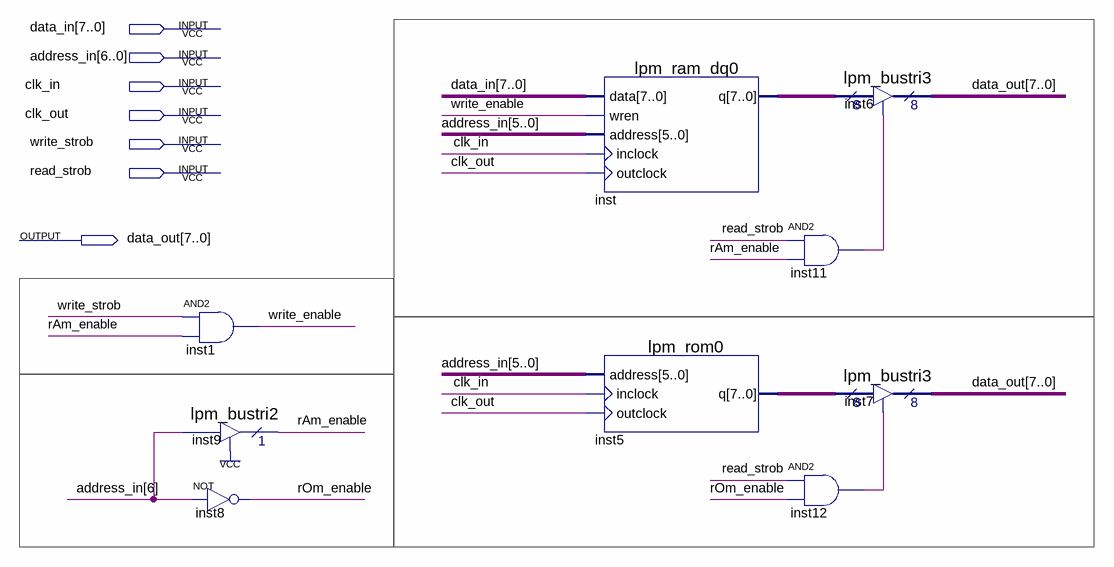
[diagram p0: schematic sheet]
// Quartus schematic MemoryBlock.bdf as structural Verilog: 9 symbols, 7 pins
module MemoryBlock (
  input  [7:0] data_in,
  input  [6:0] address_in,
  input  clk_in,
  input  clk_out,
  input  write_strob,
  input  read_strob,
  output [7:0] data_out
);

  wire inst11_out, inst12_out, rAm_enable, rOm_enable, write_enable;
  wire [7:0] inst5_q, inst_q;

  and inst1 (write_enable, write_strob, rAm_enable);
  lpm_bustri2 inst9 (.enabledt(1'b1), .data(address_in[6]), .tridata(rAm_enable));
  not inst8 (rOm_enable, address_in[6]);
  lpm_ram_dq0 inst (
    .data(data_in), .wren(write_enable), .address(address_in[5:0]), .inclock(clk_in), .outclock(clk_out),
    .q(inst_q));
  lpm_rom0 inst5 (.address(address_in[5:0]), .inclock(clk_in), .outclock(clk_out), .q(inst5_q));
  and inst11 (inst11_out, read_strob, rAm_enable);
  and inst12 (inst12_out, read_strob, rOm_enable);
  lpm_bustri3 inst6 (.enabledt(inst11_out), .data(inst_q), .tridata(data_out));
  lpm_bustri3 inst7 (.enabledt(inst12_out), .data(inst5_q), .tridata(data_out));
endmodule
